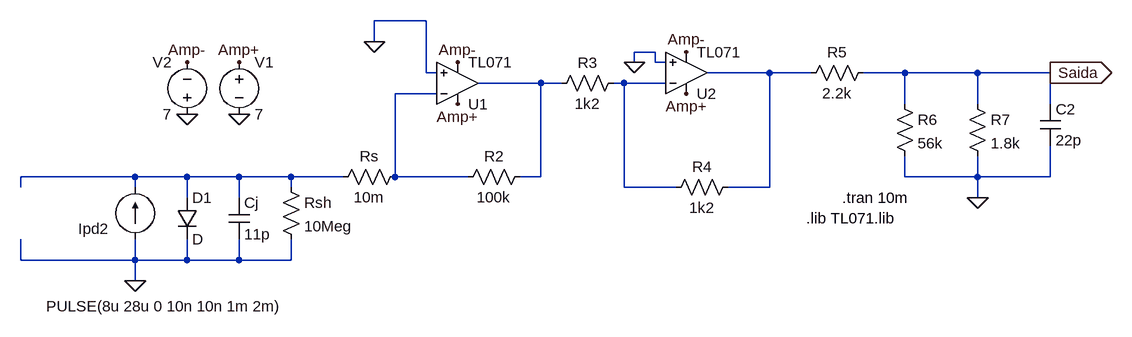
[diagram p0: schematic receptor.asc]
receptor.asc, the LTspice schematic file:
Version 4
SHEET 1 880 680
WIRE -384 48 -464 48
WIRE -464 80 -464 48
WIRE -32 96 -64 96
WIRE -64 112 -64 96
WIRE -32 112 -32 96
WIRE -16 112 -32 112
WIRE -384 128 -384 48
WIRE -368 128 -384 128
WIRE 144 128 48 128
WIRE 208 128 144 128
WIRE 352 128 288 128
WIRE 464 128 352 128
WIRE 576 128 464 128
WIRE -208 144 -304 144
WIRE -176 144 -208 144
WIRE -80 144 -96 144
WIRE -16 144 -80 144
WIRE -368 160 -432 160
WIRE 352 176 352 128
WIRE 464 176 464 128
WIRE 576 176 576 128
WIRE -832 288 -1008 288
WIRE -752 288 -832 288
WIRE -672 288 -752 288
WIRE -592 288 -672 288
WIRE -512 288 -592 288
WIRE -432 288 -432 160
WIRE -320 288 -432 288
WIRE -208 288 -208 144
WIRE -208 288 -240 288
WIRE 352 288 352 256
WIRE 464 288 464 256
WIRE 464 288 352 288
WIRE 576 288 576 240
WIRE 576 288 464 288
WIRE -1008 304 -1008 288
WIRE -832 304 -832 288
WIRE -592 304 -592 288
WIRE -80 304 -80 144
WIRE 0 304 -80 304
WIRE 144 304 144 128
WIRE 144 304 80 304
WIRE -752 320 -752 288
WIRE -672 320 -672 288
WIRE 464 320 464 288
WIRE -1008 416 -1008 384
WIRE -832 416 -832 384
WIRE -832 416 -1008 416
WIRE -752 416 -752 384
WIRE -752 416 -832 416
WIRE -672 416 -672 384
WIRE -672 416 -752 416
WIRE -592 416 -592 384
WIRE -592 416 -672 416
WIRE -832 448 -832 416
FLAG -672 112 Amp+
FLAG -672 192 0
FLAG -752 112 Amp-
FLAG -752 192 0
FLAG -336 176 Amp+
FLAG -336 112 Amp-
FLAG -464 80 0
FLAG 16 160 Amp+
FLAG 16 96 Amp-
FLAG -64 112 0
FLAG 464 320 0
FLAG 576 128 Saida
IOPIN 576 128 Out
FLAG -832 448 0
SYMBOL OpAmps\\opamp2 -336 208 M180
SYMATTR InstName U1
SYMATTR Value TL071
SYMBOL voltage -672 96 R0
WINDOW 123 0 0 Left 0
WINDOW 39 0 0 Left 0
SYMATTR InstName V1
SYMATTR Value 7
SYMBOL voltage -752 208 R180
WINDOW 0 24 96 Left 2
WINDOW 3 24 16 Left 2
WINDOW 123 0 0 Left 0
WINDOW 39 0 0 Left 0
SYMATTR InstName V2
SYMATTR Value 7
SYMBOL res -224 272 R90
WINDOW 0 0 56 VBottom 2
WINDOW 3 32 56 VTop 2
SYMATTR InstName R2
SYMATTR Value 100k
SYMBOL res -80 128 R90
WINDOW 0 0 56 VBottom 2
WINDOW 3 32 56 VTop 2
SYMATTR InstName R3
SYMATTR Value 1k2
SYMBOL OpAmps\\opamp2 16 192 M180
SYMATTR InstName U2
SYMATTR Value TL071
SYMBOL res -16 320 R270
WINDOW 0 32 56 VTop 2
WINDOW 3 0 56 VBottom 2
SYMATTR InstName R4
SYMATTR Value 1k2
SYMBOL res 192 144 R270
WINDOW 0 32 56 VTop 2
WINDOW 3 0 56 VBottom 2
SYMATTR InstName R5
SYMATTR Value 2.2k
SYMBOL res 336 160 R0
SYMATTR InstName R6
SYMATTR Value 56k
SYMBOL res 448 160 R0
SYMATTR InstName R7
SYMATTR Value 1.8k
SYMBOL cap 560 176 R0
SYMATTR InstName C2
SYMATTR Value 22p
SYMBOL diode -768 320 R0
SYMATTR InstName D1
SYMBOL cap -688 320 R0
SYMATTR InstName Cj
SYMATTR Value 11p
SYMBOL res -608 288 R0
SYMATTR InstName Rsh
SYMATTR Value 10Meg
SYMBOL res -416 272 R90
WINDOW 0 0 56 VBottom 2
WINDOW 3 32 56 VTop 2
SYMATTR InstName Rs
SYMATTR Value 10m
SYMBOL current -832 384 R180
WINDOW 3 137 -103 Right 2
WINDOW 123 0 0 Left 0
WINDOW 39 0 0 Left 0
WINDOW 0 88 16 Right 2
SYMATTR Value PULSE(8u 28u 0 10n 10n 1m 2m)
SYMATTR InstName Ipd2
TEXT 256 320 Left 2 !.tran 10m
TEXT 200 352 Left 2 !.lib TL071.lib

The netlist it stands for:
* receptor.asc
XU1 0 N004 Amp+ Amp- N002 TL071  ; pins In+ In- V+ V- OUT
V1 Amp+ 0 7
V2 0 Amp- 7
R2 N002 N004 100k
R3 N003 N002 1k2
XU2 0 N003 Amp+ Amp- N001 TL071  ; pins In+ In- V+ V- OUT
R4 N003 N001 1k2
R5 N001 Saida 2.2k
R6 Saida 0 56k
R7 Saida 0 1.8k
C2 Saida 0 22p
D1 N005 0 D
Cj N005 0 11p
Rsh N005 0 10Meg
Rs N004 N005 10m
Ipd2 0 N005 PULSE(8u 28u 0 10n 10n 1m 2m)
.model D D
.lib standard.dio
.tran 10m
.lib TL071.lib
.backanno
.end